# Altium project GT502_BGS2.PrjPcb
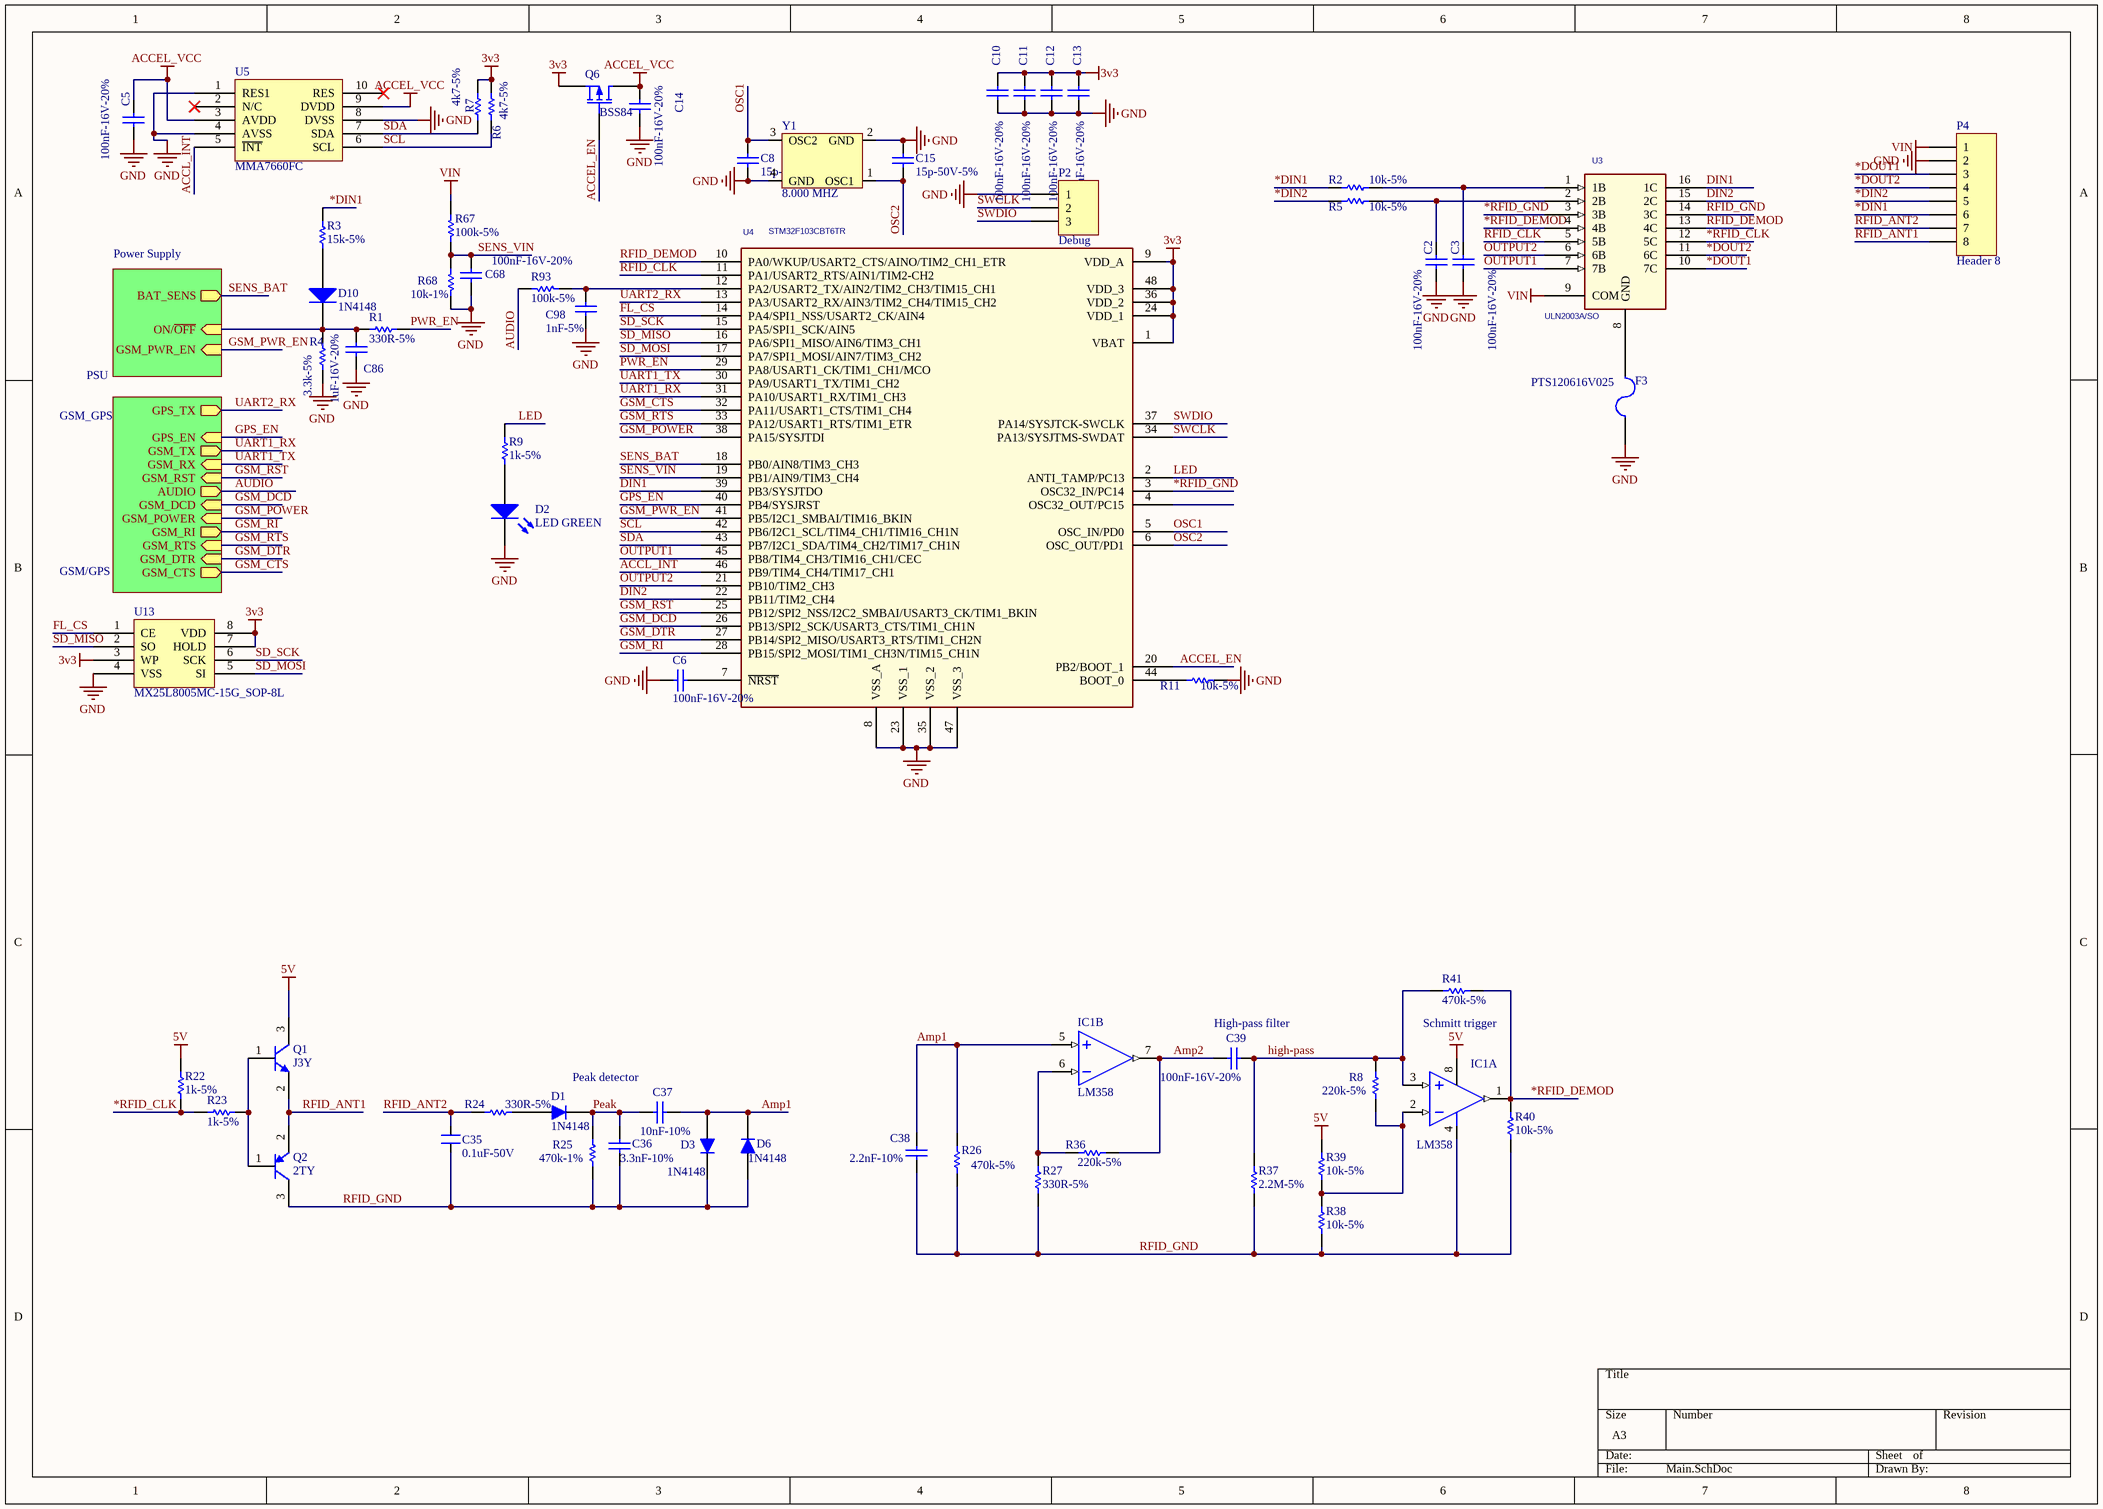
[diagram p0: Main.SchDoc]
3 sheets, 126 parts. Net scope: hierarchical (ports join the sheet entries above them; power ports are global).
Board file: GT502W_BGS2.PcbDoc
Sheets:
  Main.SchDoc
    Power Supply = PSU.SchDoc
    GSM/GPS = GSM_GPS.SchDoc

## Sheet Main.SchDoc
size A3

### Parts
C2  100nF-16V-20%  [0402_TYPE1]
C3  100nF-16V-20%  [0402_TYPE1]
C5  100nF-16V-20%  [0402_TYPE1]
C6  100nF-16V-20%  [0402_TYPE1]
C8  15p-50V-5%  [0402_TYPE1]
C10  100nF-16V-20%  [0402_TYPE1]
C11  100nF-16V-20%  [0402_TYPE1]
C12  100nF-16V-20%  [0402_TYPE1]
C13  100nF-16V-20%  [0402_TYPE1]
C14  100nF-16V-20%  [0402_TYPE1]
C15  15p-50V-5%  [0402_TYPE1]
C35  0.1uF-50V  [C0805 - TYPE3]
C36  3.3nF-10%  [0402_TYPE1]
C37  10nF-10%  [0402_TYPE1]
C38  2.2nF-10%  [0402_TYPE1]
C39  100nF-16V-20%  [0402_TYPE1]
C68  100nF-16V-20%  [0402_TYPE1]
C86  1uF-16V-20%  [0402_TYPE1]
C98  1nF-5%  [0402_TYPE1]
D1  1N4148  [DO-213AA]
D2  LED GREEN  [LED0603-G]
D3  1N4148  [DO-213AA]
D6  1N4148  [DO-213AA]
D10  1N4148  [SOD323]
F3  PTS120616V025  [PTC1206]
IC1  LM358  [soic8]  (parts A,B of 2)
P2  Debug  [HEADER_1.27mm_3PIN]
P4  Header 8  [HDR1X8]
Q1  J3Y  [SOT23_123]
Q2  2TY  [SOT23_123]
Q6  BSS84  [SOT23-3]
R1  330R-5%  [R0402_TYPE1]
R2  10k-5%  [R0402_TYPE1]
R3  15k-5%  [R0402_TYPE1]
R4  3.3k-5%  [R0402_TYPE1]
R5  10k-5%  [R0402_TYPE1]
R6  4k7-5%  [R0402_TYPE1]
R7  4k7-5%  [R0402_TYPE1]
R8  220k-5%  [R0402_TYPE1]
R9  1k-5%  [R0402_TYPE1]
R11  10k-5%  [R0402_TYPE1]
R22  1k-5%  [R0402_TYPE1]
R23  1k-5%  [R0402_TYPE1]
R24  330R-5%  [R0402_TYPE1]
R25  470k-1%  [R0402_TYPE1]
R26  470k-5%  [R0402_TYPE1]
R27  330R-5%  [R0402_TYPE1]
R36  220k-5%  [R0402_TYPE1]
R37  2.2M-5%  [R0402_TYPE1]
R38  10k-5%  [R0402_TYPE1]
R39  10k-5%  [R0402_TYPE1]
R40  10k-5%  [R0402_TYPE1]
R41  470k-5%  [R0402_TYPE1]
R67  100k-5%  [R0402_TYPE1]
R68  10k-1%  [R0402_TYPE1]
R93  100k-5%  [R0402_TYPE1]
U3  ULN2003A/SO  [SO16-150mil]
U4  STM32F103CBT6TR  [TQFP-48-P0.5]
U5  MMA7660FC  [MMA7660FC]
U13  MX25L8005MC-15G_SOP-8L  [SO8-200mil]
Y1  8.000 MHZ  [SMD CRYSTAL 4 x 2.5]

### Sub-sheets
GSM/GPS = GSM_GPS: GSM_POWER (in), GSM_RX (in), GSM_TX (out), GPS_TX (out), GSM_DCD (in), GSM_RI (out), GPS_EN (in), GSM_RST (in), GSM_RTS (in), GSM_DTR (in), GSM_CTS (out), AUDIO (out)
Power Supply = PSU: ON/~{OFF} (in), GSM_PWR_EN (in), BAT_SENS (out)

### Nets
3v3: C10.1 C11.1 C12.1 C13.1 Q6.2(S) R6.2 R7.2 U4.1(VBAT) U4.9(VDD_A) U4.24(VDD_1) U4.36(VDD_2) U4.48(VDD_3) U13.3(WP) U13.7(HOLD) U13.8(VDD)
5V: IC1.8(+V) Q1.3(C) R22.2 R39.1
ACCEL_VCC: C5.2 C14.2 Q6.3(D) U5.3(AVDD) U5.9(DVDD)
GND: C2.2 C3.2 C5.1 C6.2 C8.1 C10.2 C11.2 C12.2 C13.2 C14.1 C15.2 C68.1 C86.1 C98.1 D2.2(K) F3.2 P2.1 P4.2 R4.1 R11.1 R68.1 U4.8(VSS_A) U4.23(VSS_1) U4.35(VSS_2) U4.47(VSS_3) U5.1(RES1) U5.4(AVSS) U5.8(DVSS) U13.4(VSS) Y1.2(GND) Y1.4(GND)
VIN: P4.1 R67.1 U3.9(COM)
*DIN1: P4.6 R2.2 R3.2
*DIN2: P4.5 R5.2
*DOUT1: P4.3 U3.10(7C)
*DOUT2: P4.4 U3.11(6C)
*RFID_CLK: R22.1 R23.2 U3.12(5C)
*RFID_DEMOD: IC1.1(OUT) R40.2 R41.1 U3.4(4B)
*RFID_GND: U3.3(3B) U4.3(OSC32_IN/PC14)
ACCEL_EN: Q6.1(G) U4.20(PB2/BOOT_1)
ACCL_INT: U4.46(PB9/TIM4_CH4/TIM17_CH1) U5.5(~{INT})
Amp1: C37.2 C38.2 D3.1(A) D6.2(K) IC1.5(IN+) R26.1
Amp2: C39.2 IC1.7(OUT) R36.1
AUDIO: R93.1 ; sheet GSM/GPS/AUDIO
DIN1: U3.16(1C) U4.39(PB3/SYSJTDO)
DIN2: U3.15(2C) U4.22(PB11/TIM2_CH4)
FL_CS: U4.14(PA4/SPI1_NSS/USART2_CK/AIN4) U13.1(CE)
GPS_EN: U4.40(PB4/SYSJRST) ; sheet GSM/GPS/GPS_EN
GSM_CTS: U4.32(PA11/USART1_CTS/TIM1_CH4) ; sheet GSM/GPS/GSM_CTS
GSM_DCD: U4.26(PB13/SPI2_SCK/USART3_CTS/TIM1_CH1N) ; sheet GSM/GPS/GSM_DCD
GSM_DTR: U4.27(PB14/SPI2_MISO/USART3_RTS/TIM1_CH2N) ; sheet GSM/GPS/GSM_DTR
GSM_POWER: U4.38(PA15/SYSJTDI) ; sheet GSM/GPS/GSM_POWER
GSM_PWR_EN: U4.41(PB5/I2C1_SMBAI/TIM16_BKIN) ; sheet Power Supply/GSM_PWR_EN
GSM_RI: U4.28(PB15/SPI2_MOSI/TIM1_CH3N/TIM15_CH1N) ; sheet GSM/GPS/GSM_RI
GSM_RST: U4.25(PB12/SPI2_NSS/I2C2_SMBAI/USART3_CK/TIM1_BKIN) ; sheet GSM/GPS/GSM_RST
GSM_RTS: U4.33(PA12/USART1_RTS/TIM1_ETR) ; sheet GSM/GPS/GSM_RTS
high-pass: C39.1 IC1.3(IN+) R8.2 R37.2 R41.2
LED: R9.2 U4.2(ANTI_TAMP/PC13)
OSC1: C8.2 U4.5(OSC_IN/PD0) Y1.3(OSC2)
OSC2: C15.1 U4.6(OSC_OUT/PD1) Y1.1(OSC1)
OUTPUT1: U3.7(7B) U4.45(PB8/TIM4_CH3/TIM16_CH1/CEC)
OUTPUT2: U3.6(6B) U4.21(PB10/TIM2_CH3)
Peak: C36.1 C37.1 D1.2(K) R25.1
PWR_EN: R1.1 U4.29(PA8/USART1_CK/TIM1_CH1/MCO)
RFID_ANT1: P4.8 Q1.2(E) Q2.2(E)
RFID_ANT2: C35.2 P4.7 R24.2
RFID_CLK: U3.5(5B) U4.11(PA1/USART2_RTS/AIN1/TIM2-CH2)
RFID_DEMOD: U3.13(4C) U4.10(PA0/WKUP/USART2_CTS/AINO/TIM2_CH1_ETR)
RFID_GND: C35.1 C36.2 C38.1 D3.2(K) D6.1(A) IC1.4(-V) Q2.3(C) R25.2 R26.2 R27.1 R37.1 R38.2 R40.1 U3.14(3C)
SCL: R6.1 U4.42(PB6/I2C1_SCL/TIM4_CH1/TIM16_CH1N) U5.6(SCL)
SD_MISO: U4.16(PA6/SPI1_MISO/AIN6/TIM3_CH1) U13.2(SO)
SD_MOSI: U4.17(PA7/SPI1_MOSI/AIN7/TIM3_CH2) U13.5(SI)
SD_SCK: U4.15(PA5/SPI1_SCK/AIN5) U13.6(SCK)
SDA: R7.1 U4.43(PB7/I2C1_SDA/TIM4_CH2/TIM17_CH1N) U5.7(SDA)
SENS_BAT: U4.18(PB0/AIN8/TIM3_CH3) ; sheet Power Supply/BAT_SENS
SENS_VIN: C68.2 R67.2 R68.2 U4.19(PB1/AIN9/TIM3_CH4)
SWCLK: P2.2 U4.34(PA13/SYSJTMS-SWDAT)
SWDIO: P2.3 U4.37(PA14/SYSJTCK-SWCLK)
UART1_RX: U4.31(PA10/USART1_RX/TIM1_CH3) ; sheet GSM/GPS/GSM_TX
UART1_TX: U4.30(PA9/USART1_TX/TIM1_CH2) ; sheet GSM/GPS/GSM_RX
UART2_RX: U4.13(PA3/USART2_RX/AIN3/TIM2_CH4/TIM15_CH2) ; sheet GSM/GPS/GPS_TX
NetC2_1: C2.1 R5.1 U3.2(2B)
NetC3_1: C3.1 R2.1 U3.1(1B)
NetC6_1: C6.1 U4.7(~{NRST})
NetC86_2: C86.2 D10.2(K) R1.2 R4.2 ; sheet Power Supply/ON/~{OFF}
NetC98_2: C98.2 R93.2 U4.12(PA2/USART2_TX/AIN2/TIM2_CH3/TIM15_CH1)
NetD1_1: D1.1(A) R24.1
NetD2_1: D2.1(A) R9.1
NetD10_1: D10.1(A) R3.1
NetF3_1: F3.1 U3.8(GND)
NetIC1_2: IC1.2(IN-) R8.1 R38.1 R39.2
NetIC1_6: IC1.6(IN-) R27.2 R36.2
NetQ1_1: Q1.1(B) Q2.1(B) R23.1
NetR11_2: R11.2 U4.44(BOOT_0)

Not connected (* = marked no-connect by the designer): U4 4(OSC32_OUT/PC15); U5 2(N/C)* 10(RES)*

### Notes on the sheet
- (near C39) High-pass filter
- (near R41) Schmitt trigger
- Peak detector

### Library data of the parts
C2 C3 C5 C6 C10-C14 C39 C68 = Cap: CAP CER 0.1UF 16V Y5V 0402; Manufacturer: Yageo; Manufacturer Part Number: CC0402ZRY5V7BB104; Published: 8-Jun-2000; LatestRevisionDate: 17-Jul-2002; LatestRevisionNote: Re-released for DXP Platform.; PackageReference: C0402; Publisher: Altium Limited; Value: 100nF-16V-20%; Digi-Key Part Number: 311-1047-1-ND; Unit Price: 0.00250
C8 C15 = Cap: CAP CER 15PF 50V 5% NPO 0402; Manufacturer: Yageo; Manufacturer Part Number: CC0402JRNPO9BN150; Published: 8-Jun-2000; LatestRevisionDate: 17-Jul-2002; LatestRevisionNote: Re-released for DXP Platform.; PackageReference: C0402; Publisher: Altium Limited; Value: 15p-50V-5%; Digi-Key Part Number: 311-1017-1-ND; Unit Price: 0.00270
C35 = CN2: CAP CER 0.1UF 50V Y5V 0603; Manufacturer: Yageo; Manufacturer Part Number: CC0603ZRY5V9BB104; Digi-Key Part Number: 311-1343-2-ND; Unit Price: 0.00327; Value: 0.1uF-50V
C36 = 1nF-50V-C0805: CAP CER 3300PF 50V 10% X7R 0402; Manufacturer: Yageo; Manufacturer Part Number: CC0402KRX7R9BB332; Value: 3.3nF-10%; Digi-Key Part Number: 311-1034-2-ND; Unit Price: 0.00305
C37 = 10nF-50V-C0805: Non-Polarized Capacitor; Manufacturer: Yageo; Manufacturer Part Number: 311-1349-2-ND; Value: 10nF-10%; Digi-Key Part Number: CC0402KRX7R9BB103; Unit Price: 0.00221
C38 = 2.2nF-50V-C0805: CAP CER 2200PF 50V 10% X7R 0402; Manufacturer: Yageo; Manufacturer Part Number: CC0402KRX7R9BB222; Value: 2.2nF-10%; Digi-Key Part Number: 311-1037-2-ND; Unit Price: 0.00281
C86 = Cap: CAP CER 1UF 16V Y5V 0603; Manufacturer: Yageo; Manufacturer Part Number: CC0603ZRY5V7BB105; Published: 8-Jun-2000; LatestRevisionDate: 17-Jul-2002; LatestRevisionNote: Re-released for DXP Platform.; PackageReference: C0603; Publisher: Altium Limited; Value: 1uF-16V-20%; Digi-Key Part Number: 311-1372-1-ND; Unit Price: 0.00465
C98 = 1nF-50V-C0805: Non-Polarized Capacitor; Manufacturer: Yageo; Manufacturer Part Number: CC0805JRNPO9BN102; Value: 1nF-5%; Digi-Key Part Number: 311-1122-1-ND; Unit Price: 0.18
D1 D3 D6 = 1N4148: DIODE SMALL SIG 100V 0.2A ALF2; Manufacturer: NXP Semiconductors; Manufacturer Part Number: 1N4148,113; Digi-Key Part Number: 568-1360-1-ND; Unit Price: 0.08100
D2 = LED2: LED GREEN CLEAR THIN 0603 SMD; Manufacturer: Lite-On Inc; Manufacturer Part Number: LTST-C191KGKT; Published: 8-Jun-2000; LatestRevisionDate: 17-Jul-2002; LatestRevisionNote: Re-released for DXP Platform.; PackageVersion: Feb-2002; PackageReference: 3.2X1.6X1.1; Publisher: Altium Limited; Digi-Key Part Number: 160-1446-2-ND; Unit Price: 0.03780; Value: LED GREEN
D10 = Diode: DIODE SWITCH 75V 200MW SOD323; Manufacturer Part Number: 1N4148WS-7-F; Manufacturer: Diodes Inc; Value: 1N4007; Published: 8-Jun-2000; LatestRevisionDate: 17-Jul-2002; LatestRevisionNote: Re-released for DXP Platform.; PackageVersion: Sep-1996; PackageReference: DO-214-AA; Publisher: Altium Limited; Code_JEDEC: DO-214-AB; Digi-Key Part Number: 1N4148WS-FDITR-ND; Unit Price: 0.02933
F3 = Fuse 2: PTC RESETTABLE SMD 1206 16V .25A; Manufacturer: Cooper Bussmann; Published: 8-Jun-2000; LatestRevisionDate: 17-Jul-2002; LatestRevisionNote: Re-released for DXP Platform.; PackageReference: PIN-W2/E2.8; Publisher: Altium Limited; Digi-Key Part Number: 283-3137-2-ND; Manufacturer Part Number: 120616V025; Unit Price: 0.12375; Value: PTS120616V025; tme part: SMD1815P050TF
IC1 = LM358: Low-Power Dual Operational Amplifier; Value: LM358
P2 = Header 3: NA; LatestRevisionDate: 17-Jul-2002; LatestRevisionNote: Re-released for DXP Platform.; Publisher: Altium Limited
P4 = Header 8: Header, 8-Pin; LatestRevisionDate: 17-Jul-2002; LatestRevisionNote: Re-released for DXP Platform.; Publisher: Altium Limited
Q1 = NPN_123: NPN Bipolar Transistor
Q2 = PNP_123: PNP Bipolar Transistor
Q6 = MOSFET-P: MOSFET P-CH 50V 130MA SOT23-3; Manufacturer: Diodes Inc; Manufacturer Part Number: BSS84-7-F; Published: 8-Jun-2000; LatestRevisionDate: 17-Jul-2002; LatestRevisionNote: Re-released for DXP Platform.; PackageVersion: 1995/1996; PackageReference: E3; Publisher: Altium Limited; Digi-Key Part Number: BSS84-FDITR-ND; Unit Price: 0.06000
R1 R27 = 330R-5%-R0805: RES 330 OHM 1/8W 5% 0805 SMD; Manufacturer: Yageo; Manufacturer Part Number: RC0805JR-07330RL; Digi-Key Part Number: 311-330ARTR-ND; Unit Price: 0.00209
R2 R5 R38-R40 = 10k-5%-R0805: RES 10k OHM 1/8W 5% 0805 SMD; Manufacturer: Yageo; Manufacturer Part Number: RC0805JR-0710KL; Digi-Key Part Number: 311-10KARTR-ND; Unit Price: 0.00209
R3 = 105k-1%-R0805: RES 105k OHM 1/4W 1% 0805 SMD; Manufacturer: Yageo; Manufacturer Part Number: RC0805FR-07105KL; Digi-Key Part Number: 311-105KCRTR-ND; Unit Price: 0.00241
R4 = 26.1k-1%-R0805: RES 26.1k OHM 1/4W 1% 0805 SMD; Manufacturer: Yageo; Manufacturer Part Number: RC0805FR-0726K1L; Digi-Key Part Number: 311-26.1KCRTR-ND; Unit Price: 0.00241
R6 R7 = Res1: RES 4.7K OHM 1/16W 5% 0402 SMD; Manufacturer: Yageo; Manufacturer Part Number: RC0402JR-074K7L; Published: 8-Jun-2000; LatestRevisionDate: 17-Jul-2002; LatestRevisionNote: Re-released for DXP Platform.; PackageReference: R0603; Publisher: Altium Limited; Value: 4k7-5%; Digi-Key Part Number: 311-4.7KJRCT-ND; Unit Price: 0.00178
R8 R36 = 220k-5%-R0805: RES 220k OHM 1/8W 5% 0805 SMD; Manufacturer: Yageo; Manufacturer Part Number: RC0805JR-07220KL; Digi-Key Part Number: 311-220KARTR-ND; Unit Price: 0.00209
R9 = Res1: RES 1.0K OHM 1/16W 5% 0402 SMD; Manufacturer: Yageo; Manufacturer Part Number: RC0402JR-071KL; Published: 8-Jun-2000; LatestRevisionDate: 17-Jul-2002; LatestRevisionNote: Re-released for DXP Platform.; PackageReference: R0603; Publisher: Altium Limited; Value: 1k-5%; Digi-Key Part Number: 311-1.0KJRCT-ND; Unit Price: 0.00178
R11 = Res1: RES 10K OHM 1/16W 5% 0402 SMD; Manufacturer: Yageo; Manufacturer Part Number: RC0402JR-0710KL; Published: 8-Jun-2000; LatestRevisionDate: 17-Jul-2002; LatestRevisionNote: Re-released for DXP Platform.; PackageReference: R0603; Publisher: Altium Limited; Value: 10k-5%; Digi-Key Part Number: 311-10KJRCT-ND; Unit Price: 0.00178
R22 R23 = 1k-5%-R0805: RES 1k OHM 1/8W 5% 0805 SMD; Manufacturer: Yageo; Manufacturer Part Number: RC0805JR-071KL; Digi-Key Part Number: 311-1.0KARTR-ND; Unit Price: 0.00209
R24 = 330k-5%-R0805: RES 330 OHM 1/8W 5% 0805 SMD; Manufacturer: Yageo; Manufacturer Part Number: RC0805JR-07330RL; Digi-Key Part Number: 311-330ARTR-ND; Unit Price: 0.00209
R25 = 470k-1%-R0805: RES 470k OHM 1/4W 1% 0805 SMD; Manufacturer: Yageo; Manufacturer Part Number: RC0805FR-07470KL; Digi-Key Part Number: 311-470KCRTR-ND; Unit Price: 0.00241
R26 R41 = 470k-5%-R0805: RES 470k OHM 1/8W 5% 0805 SMD; Manufacturer: Yageo; Manufacturer Part Number: RC0805JR-07470KL; Digi-Key Part Number: 311-470KARTR-ND; Unit Price: 0.00209
R37 = 2.2M-5%-R0805: RES 2.2M OHM 1/8W 5% 0805 SMD; Manufacturer: Yageo; Manufacturer Part Number: RC0805JR-072M2L; Digi-Key Part Number: 311-2.2MARTR-ND; Unit Price: 0.00209
R67 R93 = Res1: RES 100K OHM 1/16W 5% 0402 SMD; Manufacturer: Yageo; Manufacturer Part Number: RC0402JR-07100KL; Published: 8-Jun-2000; LatestRevisionDate: 17-Jul-2002; LatestRevisionNote: Re-released for DXP Platform.; PackageReference: R0402; Publisher: Altium Limited; Value: 100k-5%; Digi-Key Part Number: 311-100KJRCT-ND; Unit Price: 0.00171
R68 = Res1: RES 10.0K OHM 1/16W 1% 0402 SMD; Manufacturer: Yageo; Manufacturer Part Number: RC0402FR-0710KL; Published: 8-Jun-2000; LatestRevisionDate: 17-Jul-2002; LatestRevisionNote: Re-released for DXP Platform.; PackageReference: R0603; Publisher: Altium Limited; Value: 10k-1%; Digi-Key Part Number: 311-10.0KLRTR-ND; Unit Price: 0.00149
U3 = ULN2003A/SO_0: IC DARL TRANS ARRAY 16-SOIC; Manufacturer Part Number: ULN2003ADR; Manufacturer: Texas Instruments; Digi-Key Part Number: 296-1368-2-ND; Unit Price: 0.144
U4 = ATmega128_4: MCU ARM 128K FLASH/TIMER; Manufacturer: STMicroelectronics; Digi-Key Part Number: 497-6288-ND; Manufacturer Part Number: STM32F103CBT6TR; Unit Price: 2
U5 = MMA7660FC: ACCELEROMETER 3X3 DGTL 10-DFN; Manufacturer: Freescale Semiconductor; Manufacturer Part Number: MMA7660FCT; Unit Price: 0.67000; Digi-Key Part Number: MMA7660FCT-ND
U13 = FlashIC: Manufacturer: Tyrone
Y1 = CRYSTAL-SMT: CRYSTAL 8.000 MHZ 18PF SMD; Manufacturer: TXC CORPORATION; Manufacturer Part Number: 7B-8.000MAAJ-T; Digi-Key Part Number: 887-1452-2-ND; Unit Price: 0.39000; Value: 8.000 MHZ

## Sheet PSU.SchDoc
size A4
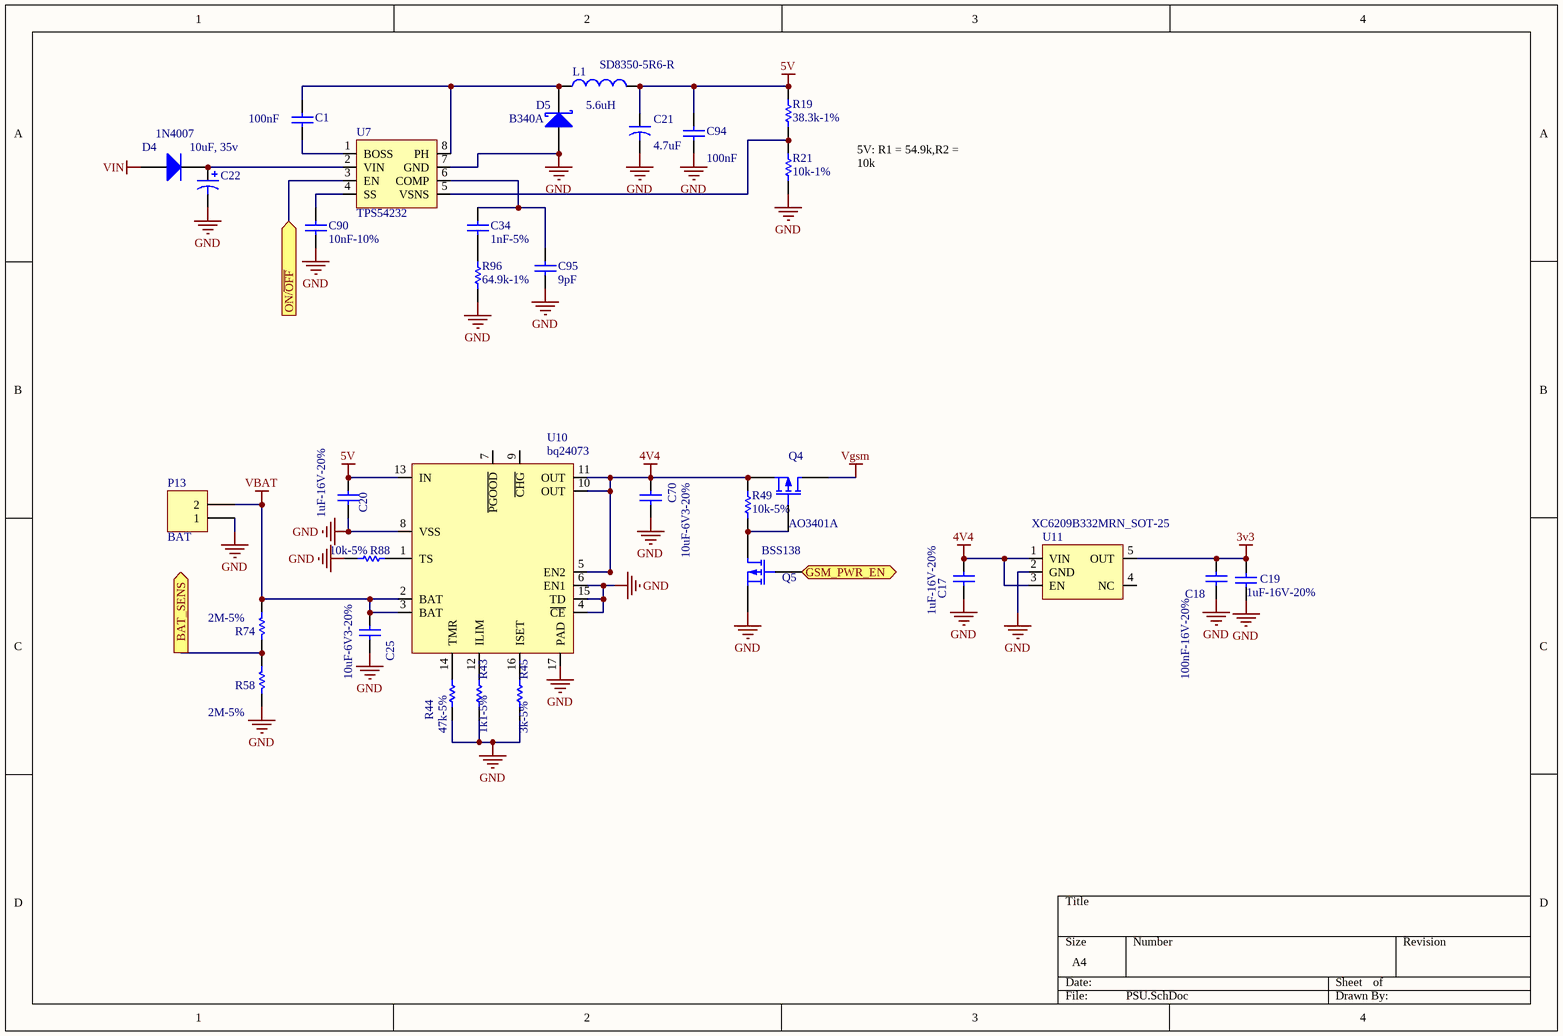
[diagram p1: PSU.SchDoc]

### Parts
C1  100nF  [0402_TYPE1]
C17  1uF-16V-20%  [C0603]
C18  100nF-16V-20%  [0402_TYPE1]
C19  1uF-16V-20%  [C0603]
C20  1uF-16V-20%  [C0603]
C21  4.7uF  [C1206]
C22  10uF, 35v  [CAPACITOR SIZE_C(D5.3)]
C25  10uF-6V3-20%  [C0603]
C34  1nF-5%  [0402_TYPE1]
C70  10uF-6V3-20%  [C0603]
C90  10nF-10%  [0402_TYPE1]
C94  100nF  [0402_TYPE1]
C95  9pF  [0402_TYPE1]
D4  1N4007  [DO-214AC (SMA)]
D5  B340A  [DO-214AC (SMA)]
L1  SD8350-5R6-R  value 5.6uH  [SD8350-5R6-R]
P13  BAT  [HDR1X2]
Q4  AO3401A  [SOT23-3]
Q5  BSS138  [SOT23-3]
R19  38.3k-1%  [R0402_TYPE1]
R21  10k-1%  [R0402_TYPE1]
R43  1k1-5%  [R0402_TYPE1]
R44  47k-5%  [R0402_TYPE1]
R45  3k-5%  [R0402_TYPE1]
R49  10k-5%  [R0402_TYPE1]
R58  2M-5%  [R0402_TYPE1]
R74  2M-5%  [R0402_TYPE1]
R88  10k-5%  [R0402_TYPE1]
R96  64.9k-1%  [R0402_TYPE1]
U7  TPS54232  [SOIC127P600-8AL]
U10  bq24073  [pq24073]
U11  XC6209B332MRN_SOT-25  [SOT23-5]

### Ports
BAT_SENS (out), GSM_PWR_EN (in), ON/~{OFF} (in)

### Nets
3v3: C18.2 C19.1 U11.5(OUT)
4V4: C17.1 C70.2 Q4.2(S) R49.1 U10.5(EN2) U10.10(OUT) U10.11(OUT) U11.1(VIN) U11.3(EN)
5V: C20.2 C21.1 C94.2 L1.2 R19.2 U10.13(IN)
GND: C17.2 C18.1 C19.2 C20.1 C21.2 C22.2 C25.1 C70.1 C90.1 C94.1 C95.1 D5.1(A) P13.1 Q5.2(S) R21.1 R43.2 R44.2 R45.2 R58.1 R88.2 R96.1 U7.7(GND) U10.4(~{CE}) U10.6(EN1) U10.8(VSS) U10.15(TD) U10.17(PAD) U11.2(GND)
VBAT: C25.2 P13.2 R74.2 U10.2(BAT) U10.3(BAT)
Vgsm: Q4.3(D)
VIN: D4.1(A)
GSM_PWR_EN: Q5.1(G) ; port GSM_PWR_EN
SENS_BAT: R58.2 R74.1 ; port BAT_SENS
NetC1_1: C1.1 D5.2(K) L1.1 U7.8(PH)
NetC1_2: C1.2 U7.1(BOSS)
NetC22_1: C22.1 D4.2(K) U7.2(VIN)
NetC34_1: C34.1 R96.2
NetC34_2: C34.2 C95.2 U7.6(COMP)
NetC86_2: U7.3(EN) ; port ON/~{OFF}
NetC90_2: C90.2 U7.4(SS)
NetQ4_1: Q4.1(G) Q5.3(D) R49.2
NetR19_1: R19.1 R21.2 U7.5(VSNS)
NetR43_1: R43.1 U10.12(ILIM)
NetR44_1: R44.1 U10.14(TMR)
NetR45_1: R45.1 U10.16(ISET)
NetR88_1: R88.1 U10.1(TS)

Not connected (* = marked no-connect by the designer): U10 7(~{PGOOD}) 9(~{CHG}); U11 4(NC)

### Notes on the sheet
- 5V: R1 = 54.9k,R2 = 10k

### Library data of the parts
C1 C94 = Cap: Capacitor; Published: 8-Jun-2000; LatestRevisionDate: 17-Jul-2002; LatestRevisionNote: Re-released for DXP Platform.; PackageReference: RAD-0.3; Publisher: Altium Limited; Value: 100nF
C17 C19 C20 = Cap: as C86 on sheet Main; Published: 8-Jun-2000; LatestRevisionDate: 17-Jul-2002; LatestRevisionNote: Re-released for DXP Platform.; PackageReference: C0603; Publisher: Altium Limited; Value: 1uF-16V-20%; Digi-Key Part Number: 311-1372-1-ND; Unit Price: 0.00465
C18 = Cap: as C2 on sheet Main; Published: 8-Jun-2000; LatestRevisionDate: 17-Jul-2002; LatestRevisionNote: Re-released for DXP Platform.; PackageReference: C0402; Publisher: Altium Limited; Value: 100nF-16V-20%; Digi-Key Part Number: 311-1047-1-ND; Unit Price: 0.00250
C21 = Cap2: Capacitor; Published: 23-Sep-2002; PackageReference: CAPR5-4X5; Publisher: Altium Limited; Value: 4.7uF
C22 = Cap Pol3: CAP ALUM 10UF 35V 20% SMD; Manufacturer: Panasonic Electronic Components; Manufacturer Part Number: EEE-1VA100SR; Published: 8-Jun-2000; LatestRevisionDate: 29-May-2009; LatestRevisionNote: IPC-7351 Footprint Added.; PackageReference: C0805; Publisher: Altium Limited; PackageDescription: Chip Capacitor; Digi-Key Part Number: PCE3947TR-ND; Unit Price: 0.07875
C25 C70 = Cap: CAP CER 10UF 6.3V 20% X5R 0603; Manufacturer: Yageo; Manufacturer Part Number: CC0603MRX5R5BB106; Published: 8-Jun-2000; LatestRevisionDate: 17-Jul-2002; LatestRevisionNote: Re-released for DXP Platform.; PackageReference: C0603; Publisher: Altium Limited; Value: 10uF-6V3-20%; Digi-Key Part Number: 311-1448-1-ND; Unit Price: 0.06176
C34 = 1nF-50V-C0805: as C98 on sheet Main; Value: 1nF-5%; Digi-Key Part Number: 311-1122-1-ND; Unit Price: 0.18
C90 = 10nF-50V-C0805: Non-Polarized Capacitor; Manufacturer: Yageo; Manufacturer Part Number: CC0805KRX7R9BB103; Value: 10nF-10%; Digi-Key Part Number: 311-1136-1-ND; Unit Price: 0.1
C95 = 9pF-50V-C0805: Non-Polarized Capacitor; Manufacturer: Yageo; Manufacturer Part Number: CC0805DRNPO9BN9R0; Value: 9pF; Digi-Key Part Number: 311-1098-1-ND; Unit Price: 0.1
D4 = Diode: DIODE GEN PURPOSE 1000V 1A SMA; Manufacturer Part Number: CGRA4007-G; Manufacturer: Comchip Technology; Published: 8-Jun-2000; LatestRevisionDate: 17-Jul-2002; LatestRevisionNote: Re-released for DXP Platform.; PackageVersion: Sep-1996; PackageReference: DO-214-AA; Publisher: Altium Limited; Code_JEDEC: DO-214-AB; Value: 1N4007; Digi-Key Part Number: 641-1018-1-ND; Unit Price: 0.05130
D5 = D Schottky: DIODE SCHOTTKY 40V 3A SMA; Manufacturer Part Number: B340A-E3/61T; Manufacturer: Vishay General Semiconductor; Published: 8-Jun-2000; LatestRevisionDate: 17-Jul-2002; LatestRevisionNote: Re-released for DXP Platform.; PackageReference: DO-214-AA; Publisher: Altium Limited; Code_JEDEC: DO-214-AA; Unit Price: 0.15840; Digi-Key Part Number: B340A-E3/61TGITR-ND
L1 = Inductor: Digikey part SD8350-4R7-R; Code_IEC: 1005; Published: 8-Jun-2000; LatestRevisionDate: 29-May-2009; LatestRevisionNote: IPC-7351 Footprint Added.; PackageReference: 0402-A; Publisher: Altium Limited; PackageDescription: Chip Inductor; Code_JEITA: 0402
P13 = Header 2: Header, 2-Pin; LatestRevisionDate: 17-Jul-2002; LatestRevisionNote: Re-released for DXP Platform.; Publisher: Altium Limited
Q4 = MOSFET-P: MOSFET P-CH -30V -4.3A SOT23; Manufacturer: Alpha & Omega Semiconductor Inc; Remark: NA; Published: 8-Jun-2000; LatestRevisionDate: 17-Jul-2002; LatestRevisionNote: Re-released for DXP Platform.; PackageVersion: 1995/1996; PackageReference: E3; Publisher: Altium Limited; Digi-Key Part Number: 785-1001-1-ND; Manufacturer Part Number: AO3401A; Unit Price: 0.12400
Q5 = MOSFET-P: MOSFET N-CH 50V 200MA SOT23-3; Manufacturer: Diodes Inc; Manufacturer Part Number: BSS138-7-F; Published: 8-Jun-2000; LatestRevisionDate: 17-Jul-2002; LatestRevisionNote: Re-released for DXP Platform.; PackageVersion: 1995/1996; PackageReference: E3; Publisher: Altium Limited; Digi-Key Part Number: BSS138-FDICT-ND; Unit Price: 0.06575
R19 = 38.3k-1%-R0805: RES 38.3k OHM 1/4W 1% 0805 SMD; Manufacturer: Yageo; Manufacturer Part Number: RC0805FR-0738K3L; Digi-Key Part Number: 311-38.3KCRTR-ND; Unit Price: 0.00241
R21 = 10k-1%-R0805: RES 10k OHM 1/4W 1% 0805 SMD; Manufacturer: Yageo; Manufacturer Part Number: RC0805FR-0710KL; Digi-Key Part Number: 311-10.0KCRTR-ND; Unit Price: 0.00241
R43 = Res1: RES 1.1K OHM 1/16W 5% 0402 SMD; Manufacturer: Yageo; Manufacturer Part Number: RC0402JR-071K1L; Published: 8-Jun-2000; LatestRevisionDate: 17-Jul-2002; LatestRevisionNote: Re-released for DXP Platform.; PackageReference: R0603; Publisher: Altium Limited; Value: 1k1-5%; Digi-Key Part Number: 311-1.1KJRCT-ND; Unit Price: 0.00207
R44 = Res1: RES 47K OHM 1/16W 5% 0402 SMD; Manufacturer: Yageo; Manufacturer Part Number: RC0402JR-0747KL; Published: 8-Jun-2000; LatestRevisionDate: 17-Jul-2002; LatestRevisionNote: Re-released for DXP Platform.; PackageReference: R0603; Publisher: Altium Limited; Value: 47k-5%; Digi-Key Part Number: 311-47KJRCT-ND; Unit Price: 0.00178
R45 = Res1: RES 1.5K OHM 1/16W 5% 0402 SMD; Manufacturer: Yageo; Manufacturer Part Number: RC0402JR-073KL; Published: 8-Jun-2000; LatestRevisionDate: 17-Jul-2002; LatestRevisionNote: Re-released for DXP Platform.; PackageReference: R0603; Publisher: Altium Limited; Value: 3k-5%; Digi-Key Part Number: 311-3.0KJRCT-ND; Unit Price: 0.00207
R49 R88 = Res1: as R11 on sheet Main; Published: 8-Jun-2000; LatestRevisionDate: 17-Jul-2002; LatestRevisionNote: Re-released for DXP Platform.; PackageReference: R0603; Publisher: Altium Limited; Value: 10k-5%; Digi-Key Part Number: 311-10KJRCT-ND; Unit Price: 0.00178
R58 = Res1: RES 100K OHM 1/16W 5% 0402 SMD; Manufacturer: Samsung Electro-Mechanics America, Inc; Manufacturer Part Number: RC1005F205CS; Published: 8-Jun-2000; LatestRevisionDate: 17-Jul-2002; LatestRevisionNote: Re-released for DXP Platform.; PackageReference: R0402; Publisher: Altium Limited; Value: 2M-5%; Digi-Key Part Number: 1276-4293-2-ND; Unit Price: 0.00171
R74 = Res1: RES 2M OHM 1/16W 1% 0402; Manufacturer: Samsung Electro-Mechanics America, Inc; Manufacturer Part Number: RC1005F205CS; Published: 8-Jun-2000; LatestRevisionDate: 17-Jul-2002; LatestRevisionNote: Re-released for DXP Platform.; PackageReference: R0402; Publisher: Altium Limited; Value: 2M-5%; Digi-Key Part Number: 1276-4293-2-ND; Unit Price: 0.00171
R96 = 64.9k-1%-R0805: RES 64.9k OHM 1/4W 1% 0805 SMD; Manufacturer: Yageo; Manufacturer Part Number: RC0805FR-0764K9L; Digi-Key Part Number: 311-64.9KCRTR-ND; Unit Price: 0.00241
U7 = Component_1
U10 = BATTERY_CHARGER: IC LI-ION CHARGE/PWR MGMT 16-QFN; Manufacturer: Texas Instruments; Manufacturer Part Number: BQ24073RGTT; Digi-Key Part Number: 296-23839-1-ND; Unit Price: 1.00; PackageReference: QFN, 16-Leads; Value: bq24073
U11 = XC6209B332MRN_SOT-25: Manufacturer: Tyrone

## Sheet GSM_GPS.SchDoc
size A4
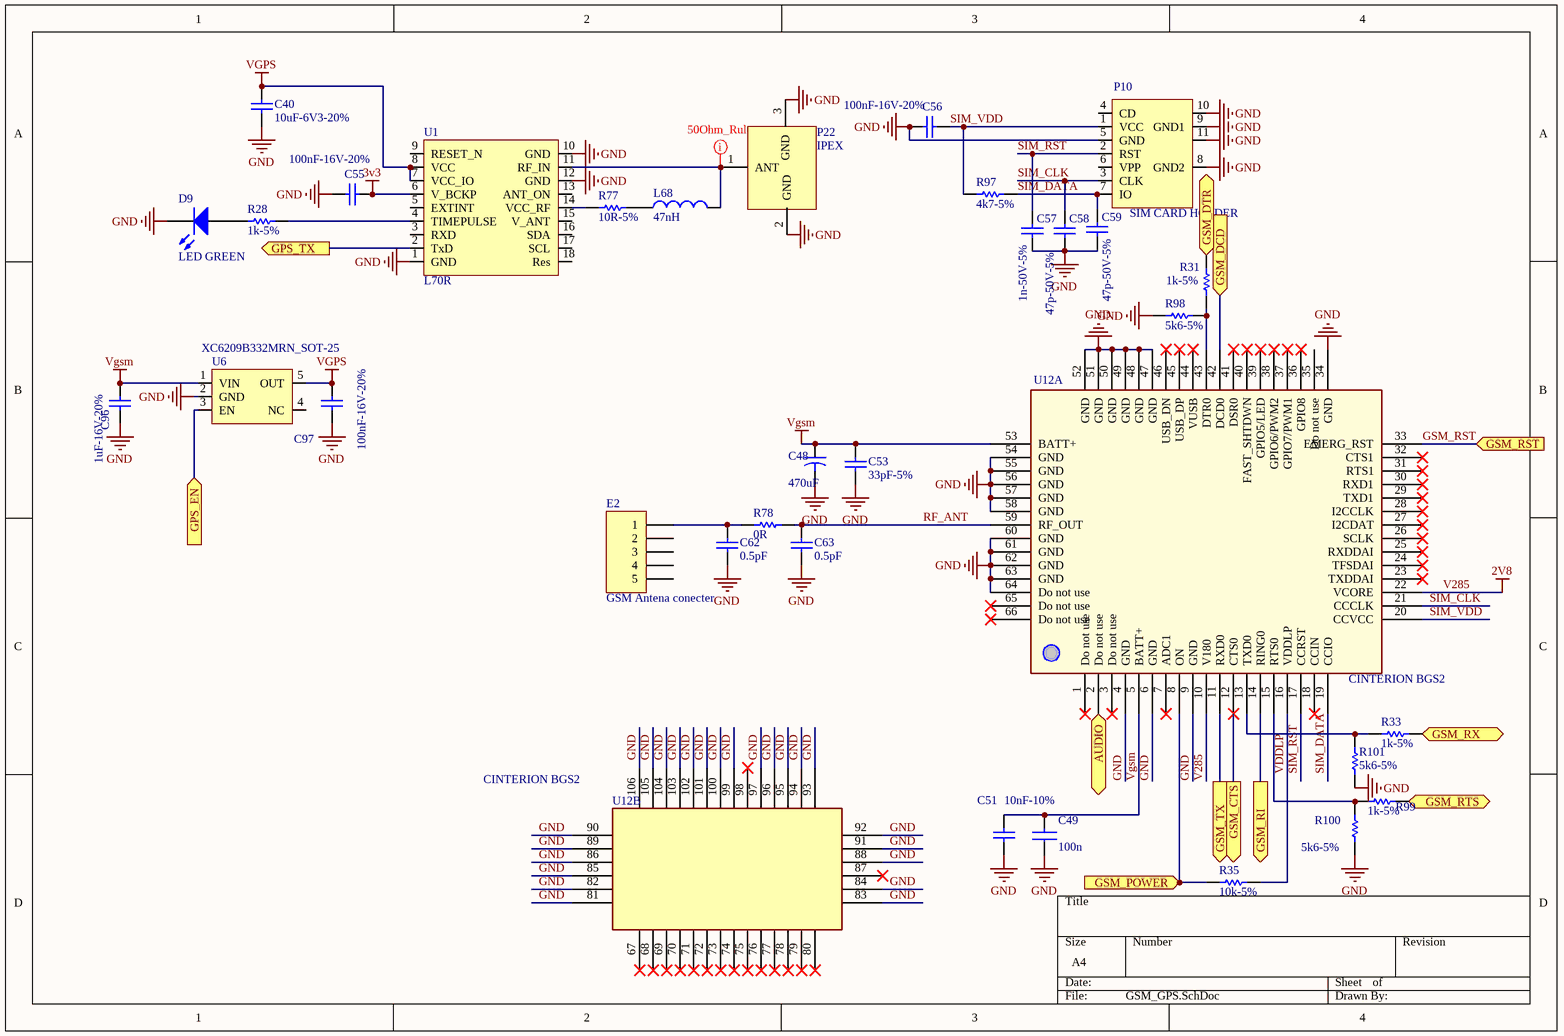
[diagram p2: GSM_GPS.SchDoc]

### Parts
C40  10uF-6V3-20%  [C0603]
C48  470uF  [C2917_smd]
C49  100n  [0402_TYPE1]
C51  10nF-10%  [0402_TYPE1]
C53  33pF-5%  [0402_TYPE1]
C55  100nF-16V-20%  [0402_TYPE1]
C56  100nF-16V-20%  [0402_TYPE1]
C57  1n-50V-5%  [0402_TYPE1]
C58  47p-50V-5%  [0402_TYPE1]
C59  47p-50V-5%  [0402_TYPE1]
C62  0.5pF  [0402_TYPE1]
C63  0.5pF  [0402_TYPE1]
C96  1uF-16V-20%  [C0603]
C97  100nF-16V-20%  [0402_TYPE1]
D9  LED GREEN  [LED0603-G]
E2  GSM Antena conecter  [A10343-GSM850/900/1800/1900/WCDMA]
L68  47nH  [C0603]
P10  SIM CARD HOLDER  [SIM MF01-412-063X]
P22  IPEX  [IPEX]
R28  1k-5%  [R0402_TYPE1]
R31  1k-5%  [R0402_TYPE1]
R33  1k-5%  [R0402_TYPE1]
R35  10k-5%  [R0402_TYPE1]
R77  10R-5%  [R0402_TYPE1]
R78  0R  [R0402_TYPE1]
R97  4k7-5%  [R0402_TYPE1]
R98  5k6-5%  [R0402_TYPE1]
R99  1k-5%  [R0402_TYPE1]
R100  5k6-5%  [R0402_TYPE1]
R101  5k6-5%  [R0402_TYPE1]
U1  L70R  [MAX7]
U6  XC6209B332MRN_SOT-25  [SOT23-5]
U12  CINTERION BGS2  [CINTERION BGS2]  (parts A,B of 2)

### Ports
AUDIO (out), GPS_EN (in), GPS_TX (out), GSM_CTS (out), GSM_DCD (in), GSM_DTR (in), GSM_POWER (in), GSM_RI (out), GSM_RST (in), GSM_RTS (in), GSM_RX (in), GSM_TX (out)

### Nets
3v3: C55.1 U1.6(V_BCKP)
GND: C40.1 C48.2 C49.1 C51.1 C53.2 C55.2 C56.2 C57.1 C58.1 C59.1 C62.1 C63.1 C96.1 C97.1 D9.2(K) P10.5(GND) P10.8(GND2) P10.9(GND1) P10.10(GND3) P10.11(GND4) P22.2(GND) P22.3(GND) R98.2 R100.2 R101.2 U1.1(GND) U1.10(GND) U1.12(GND) U6.2(GND) U12.4(GND) U12.6(GND) U12.9(GND) U12.34(GND) U12.47(GND) U12.48(GND) U12.49(GND) U12.50(GND) U12.51(GND) U12.52(GND) U12.54(GND) U12.55(GND) U12.56(GND) U12.57(GND) U12.58(GND) U12.60(GND) U12.61(GND) U12.62(GND) U12.63(GND) U12.64(Do_not_use) U12.81(GND) U12.82(GND) U12.83(GND) U12.84(GND) U12.85(GND) U12.86(GND) U12.88(GND) U12.89(GND) U12.90(GND) U12.91(GND) U12.92(GND) U12.93(GND) U12.94(GND) U12.95(GND) U12.96(GND) U12.97(GND) U12.99(GND) U12.100(GND) U12.101(GND) U12.102(GND) U12.103(GND) U12.104(GND) U12.105(GND) U12.106(GND)
V285: U12.10(V180) U12.22(VCORE)  [also labelled 2V8]
VGPS: C40.2 C97.2 U1.7(VCC_IO) U1.8(VCC) U6.5(OUT)
Vgsm: C48.1 C49.2 C51.2 C53.1 C96.2 U6.1(VIN) U12.5(BATT+) U12.53(BATT+)
AUDIO: U12.2(Do_not_use) ; port AUDIO
GPS_EN: U6.3(EN) ; port GPS_EN
GSM_CTS: U12.12(CTS0) ; port GSM_CTS
GSM_DCD: U12.42(DCD0) ; port GSM_DCD
GSM_DTR: R31.1 ; port GSM_DTR
GSM_POWER: R35.1 U12.8(ON) ; port GSM_POWER
GSM_RI: U12.14(RING0) ; port GSM_RI
GSM_RST: U12.33(EMERG_RST) ; port GSM_RST
GSM_RTS: R99.2 ; port GSM_RTS
RF_ANT: C63.2 R78.1 U12.59(RF_OUT)
SIM_CLK: C58.2 P10.3(CLK) U12.21(CCCLK)
SIM_DATA: C59.2 P10.7(IO) R97.1 U12.19(CCIO)
SIM_RST: C57.2 P10.2(RST) U12.17(CCRST)
SIM_VDD: C56.1 P10.1(VCC) R97.2 U12.20(CCVCC)
UART1_RX: U12.11(RXD0) ; port GSM_TX
UART1_TX: R33.2 ; port GSM_RX
UART2_RX: U1.2(TxD) ; port GPS_TX
VDDLP: R35.2 U12.16(VDDLP)
NetC62_2: C62.2 E2.1 R78.2
NetD9_1: D9.1(A) R28.2
NetL68_1: L68.1 R77.1
NetL68_2: L68.2 P22.1(ANT) U1.11(RF_IN)
NetR28_1: R28.1 U1.4(TIMEPULSE)
NetR31_2: R31.2 R98.1 U12.43(DTR0)
NetR33_1: R33.1 R101.1 U12.13(TXD0)
NetR77_2: R77.2 U1.14(VCC_RF)
NetR99_1: R99.1 R100.1 U12.15(RTS0)

Not connected (* = marked no-connect by the designer): E2 2 3 4 5; P10 4(CD) 6(VPP); U1 3(RXD) 5(EXTINT) 9(RESET_N) 13(ANT_ON) 15(V_ANT) 16(SDA) 17(SCL) 18(Res); U6 4(NC); U12 1(Do_not_use)* 3(Do_not_use)* 7(ADC1)* 18(CCIN)* 23(TXDDAI)* 24(TFSDAI)* 25(RXDDAI)* 26(SCLK)* 27(I2CDAT)* 28(I2CCLK)* 29(TXD1)* 30(RXD1)* 31(RTS1)* 32(CTS1)* 35(Do_not_use) 36(GPIO8)* 37(GPIO7/PWM1)* 38(GPIO6/PWM2)* 39(GPIO5/LED)* 40(FAST_SHTDWN)* 41(DSR0)* 44(VUSB)* 45(USB_DP)* 46(USB_DN)* 65(Do_not_use)* 66(Do_not_use)* 67(GND)* 68(GND)* 69(GND)* 70(GND)* 71(GND)* 72(GND)* 73(GND)* 74(GND)* 75(GND)* 76(GND)* 77(GND)* 78(GND)* 79(GND)* 80(GND)* 87(GND)* 98(GND)*

### Layout directives
rule Width Constraint [Pref Width = 26mil    Min Width = 26mil    Max Width = 26mil]; rule Clearance Constraint [Clearance = 10mil]: NetL68_2

### Library data of the parts
C40 = Cap: CAP CER 10UF 6.3V 20% X5R 0603; Manufacturer: Murata Electronics North America; Manufacturer Part Number: GRM188R60J106ME47D; Published: 8-Jun-2000; LatestRevisionDate: 17-Jul-2002; LatestRevisionNote: Re-released for DXP Platform.; PackageReference: C0603; Publisher: Altium Limited; Value: 10uF-6V3-20%; Digi-Key Part Number: 490-3896-1-ND; Unit Price: 0.07873
C48 = Cap2: CAP TANT 470UF 6.3V 10% 2917; Manufacturer: Kemet; Manufacturer Part Number: T495D477K006ATE100; Published: 23-Sep-2002; PackageReference: CAPR5-4X5; Publisher: Altium Limited; Value: 470uF; Digi-Key Part Number: 399-4701-2-ND; Unit Price: 0.5
C49 = CAP NP: CAP CER 0.1UF 16V 10% X7R 0805; Manufacturer: Yageo; Manufacturer Part Number: CC0805KRX7R7BB104; Digi-Key Part Number: 311-1142-2-ND; Unit Price: 0.003800
C51 = 10nF-50V-C0805: as C90 on sheet PSU; Value: 10nF-10%; Digi-Key Part Number: 311-1136-1-ND; Unit Price: 0.1
C53 = 33pF-50V-C0805: Non-Polarized Capacitor; Manufacturer: Yageo; Manufacturer Part Number: CC0805JRNPO9BN330; Value: 33pF-5%; Digi-Key Part Number: 311-1105-1-ND; Unit Price: 0.1
C55 C56 C97 = Cap: as C2 on sheet Main; Published: 8-Jun-2000; LatestRevisionDate: 17-Jul-2002; LatestRevisionNote: Re-released for DXP Platform.; PackageReference: C0402; Publisher: Altium Limited; Value: 100nF-16V-20%; Digi-Key Part Number: 311-1047-1-ND; Unit Price: 0.00250
C57-C59 = Cap: CAP CER 47PF 50V 5% NPO 0402; Manufacturer: Yageo; Manufacturer Part Number: CC0402JRNPO9BN470; Published: 8-Jun-2000; LatestRevisionDate: 17-Jul-2002; LatestRevisionNote: Re-released for DXP Platform.; PackageReference: C0603; Publisher: Altium Limited; Digi-Key Part Number: 311-1021-1-ND; Unit Price: 0.00270
  C57: Value: 1n-50V-5%
  C58 C59: Value: 47p-50V-5%
C62 C63 = 0.5pF-50V-C0805: Non-Polarized Capacitor; Manufacturer: Yageo; Manufacturer Part Number: CC0805CRNPO9BNR50; Value: 0.5pF; Digi-Key Part Number: 311-1094-1-ND; Unit Price: 0.1
C96 = Cap: as C86 on sheet Main; Published: 8-Jun-2000; LatestRevisionDate: 17-Jul-2002; LatestRevisionNote: Re-released for DXP Platform.; PackageReference: C0603; Publisher: Altium Limited; Value: 1uF-16V-20%; Digi-Key Part Number: 311-1372-1-ND; Unit Price: 0.00465
D9 = LED2: as D2 on sheet Main; Published: 8-Jun-2000; LatestRevisionDate: 17-Jul-2002; LatestRevisionNote: Re-released for DXP Platform.; PackageVersion: Feb-2002; PackageReference: 3.2X1.6X1.1; Publisher: Altium Limited; Digi-Key Part Number: 160-1446-2-ND; Unit Price: 0.03780; Value: LED GREEN
E2 = Header 5: Header, 5-Pin; LatestRevisionDate: 17-Jul-2002; LatestRevisionNote: Re-released for DXP Platform.; Publisher: Altium Limited
L68 = Inductor: Code_IEC: 1005; Published: 8-Jun-2000; LatestRevisionDate: 29-May-2009; LatestRevisionNote: IPC-7351 Footprint Added.; PackageReference: 0402-A; Publisher: Altium Limited; PackageDescription: Chip Inductor; Code_JEITA: 0402; Value: 47nH
P10 = SIM CARD: SIM _CONNECTOR_410108105011-2LF; Manufacturer: Tyrone
R28 R31 R33 R99 = Res1: as R9 on sheet Main; Published: 8-Jun-2000; LatestRevisionDate: 17-Jul-2002; LatestRevisionNote: Re-released for DXP Platform.; PackageReference: R0603; Publisher: Altium Limited; Value: 1k-5%; Digi-Key Part Number: 311-1.0KJRCT-ND; Unit Price: 0.00178
R35 = Res1: as R11 on sheet Main; Published: 8-Jun-2000; LatestRevisionDate: 17-Jul-2002; LatestRevisionNote: Re-released for DXP Platform.; PackageReference: R0603; Publisher: Altium Limited; Value: 10k-5%; Digi-Key Part Number: 311-10KJRCT-ND; Unit Price: 0.00178
R77 = 10R-5%-R0402: RES 10 OHM 1/16W 5% 0402 SMD; Manufacturer: Yageo; Manufacturer Part Number: RC0402JR-0710RL; Digi-Key Part Number: 311-10JRTR-ND; Unit Price: 0.00130
R78 = 0R-0805
R97 R98 R100 R101 = Res1: as R6 on sheet Main; Published: 8-Jun-2000; LatestRevisionDate: 17-Jul-2002; LatestRevisionNote: Re-released for DXP Platform.; PackageReference: R0603; Publisher: Altium Limited; Digi-Key Part Number: 311-4.7KJRCT-ND; Unit Price: 0.00178
  R97: Value: 4k7-5%
  R98 R100 R101: Value: 5k6-5%
U1 = MAX-7
U6 = XC6209B332MRN_SOT-25: Manufacturer: Tyrone
U12 = CINTERION EHS5: Name: BGS2

## Nets that join several sheets
3v3: Main (15 pins), PSU (C18.2 C19.1 U11.5), GSM_GPS (C55.1 U1.6)
5V: Main (IC1.8 Q1.3 R22.2 R39.1), PSU (6 pins)
GND: Main (31 pins), PSU (28 pins), GSM_GPS (73 pins)
Vgsm: PSU (Q4.3), GSM_GPS (8 pins)
VIN: Main (P4.1 R67.1 U3.9), PSU (D4.1)
AUDIO: Main (R93.1), GSM_GPS (U12.2)
GPS_EN: Main (U4.40), GSM_GPS (U6.3)
GSM_CTS: Main (U4.32), GSM_GPS (U12.12)
GSM_DCD: Main (U4.26), GSM_GPS (U12.42)
GSM_DTR: Main (U4.27), GSM_GPS (R31.1)
GSM_POWER: Main (U4.38), GSM_GPS (R35.1 U12.8)
GSM_PWR_EN: Main (U4.41), PSU (Q5.1)
GSM_RI: Main (U4.28), GSM_GPS (U12.14)
GSM_RST: Main (U4.25), GSM_GPS (U12.33)
GSM_RTS: Main (U4.33), GSM_GPS (R99.2)
NetC86_2: Main (C86.2 D10.2 R1.2 R4.2), PSU (U7.3)
SENS_BAT: Main (U4.18), PSU (R58.2 R74.1)
UART1_RX: Main (U4.31), GSM_GPS (U12.11)
UART1_TX: Main (U4.30), GSM_GPS (R33.2)
UART2_RX: Main (U4.13), GSM_GPS (U1.2)